# EAGLE design RGBLEDMatrixBPack (EAGLE 6.5.0)
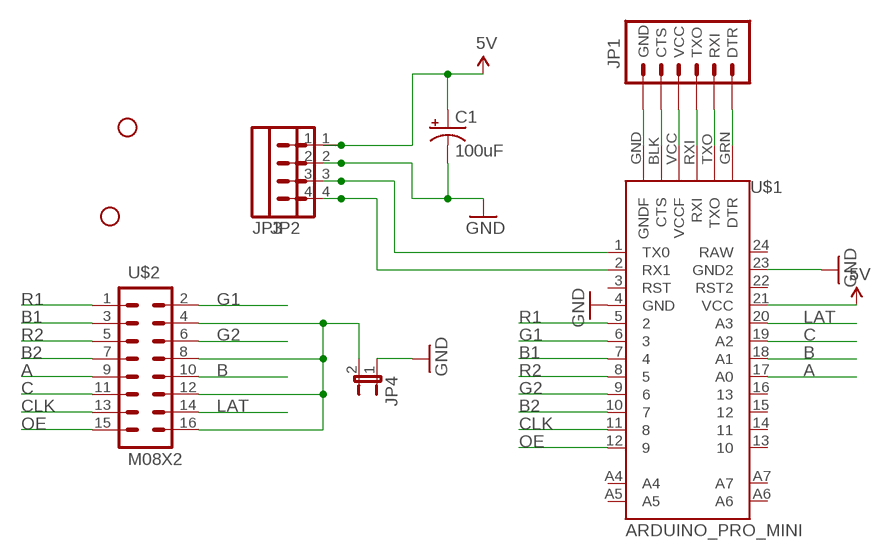
[diagram p0: schematic, sheet 1]

## Parts
C1  100uF  CAP_POLPTH1  [CPOL-RADIAL-100UF-25V]
JP1  ARDUINO_SERIAL_PROGRAMPTH  [1X06]
JP2  M04JST-PTH  [JST-4-PTH]
JP3  M04JST-PTH  [JST-4-PTH]
JP4  JUMPER-2SMD-NO  [SJ_2S-NO]
STANDOFF1  STAND-OFF  [STAND-OFF]
STANDOFF2  STAND-OFF  [STAND-OFF]
U$1  ARDUINO_PRO_MINI  [ARDUINO_PRO_MINI]
U$2  M08X2  [2X8]

## Nets
5V: C1.1(+) JP2.1 JP3.1 U$1.21(VCC)
A: U$1.17(A0) U$2.9
B: U$1.18(A1) U$2.10
B1: U$1.7 U$2.3
B2: U$1.10 U$2.7
C: U$1.19(A2) U$2.11
CLK: U$1.11 U$2.13
G1: U$1.6 U$2.2
G2: U$1.9 U$2.6
GND: C1.2(-) JP2.2 JP3.2 JP4.1 U$1.4(GND) U$1.23(GND2)
LAT: U$1.20(A3) U$2.14
N$1: JP1.1(DTR) U$1.GRN(DTR)
N$2: JP1.2(RXI) U$1.TXO
N$3: JP1.3(TXO) U$1.RXI
N$4: JP1.4(VCC) U$1.VCC(VCCF)
N$5: JP1.5(CTS) U$1.BLK(CTS)
N$6: JP1.6(GND) U$1.GND(GNDF)
N$7: JP2.4 JP3.4 U$1.2(RX1)
N$8: JP2.3 JP3.3 U$1.1(TX0)
N$9: JP4.2 U$2.4 U$2.8 U$2.12 U$2.16
OE: U$1.12 U$2.15
R1: U$1.5 U$2.1
R2: U$1.8 U$2.5
Unconnected: U$1.3(RST) U$1.13 U$1.14 U$1.15 U$1.16 U$1.22(RST2) U$1.24(RAW) U$1.A4 U$1.A5 U$1.A6 U$1.A7

## Library data of the parts
C1 = SparkFun-Capacitors:CAP_POL: Capacitor Polarized These are standard SMD and PTH capacitors. Normally 10uF, 47uF, and 100uF in electrolytic and tantalum varieties. Always verify the external diameter of the through hole cap, it varies with capacity, voltage, and manufacturer. The EIA devices should be standard.
JP1 = SparkFun-Connectors:ARDUINO_SERIAL_PROGRAM: FTDI connector footprints
JP2 JP3 = SparkFun-Connectors:M04: Header 4 Standard 4-pin 0.1" header. Use with straight break away headers (SKU : PRT-00116), right angle break away headers (PRT-00553), swiss pins (PRT-00743), machine pins (PRT-00117), and female headers (PRT-00115). Molex polarized connector foot print use with SKU : PRT-08231 with associated crimp pins and housings. 1MM SMD Version SKU: PRT-10208
JP4 = SparkFun-Passives:JUMPER-2: Jumper Basic 0.1" spaced jumper. Use with breakaway headers.
STANDOFF1 STANDOFF2 = SparkFun-Electromechanical:STAND-OFF: #4 Stand Off This is the mechanical footprint for a #4 phillips button head screw. Use the keepout ring to avoid running the screw head into surrounding components. SKU : PRT-00447
U$1 = SparkFun-Boards:ARDUINO_PRO_MINI
U$2 = SparkFun-Connectors:M08X2: .1" headers, two rows of 8 each

## Net classes
0 default: width 0.254 mm

## Board
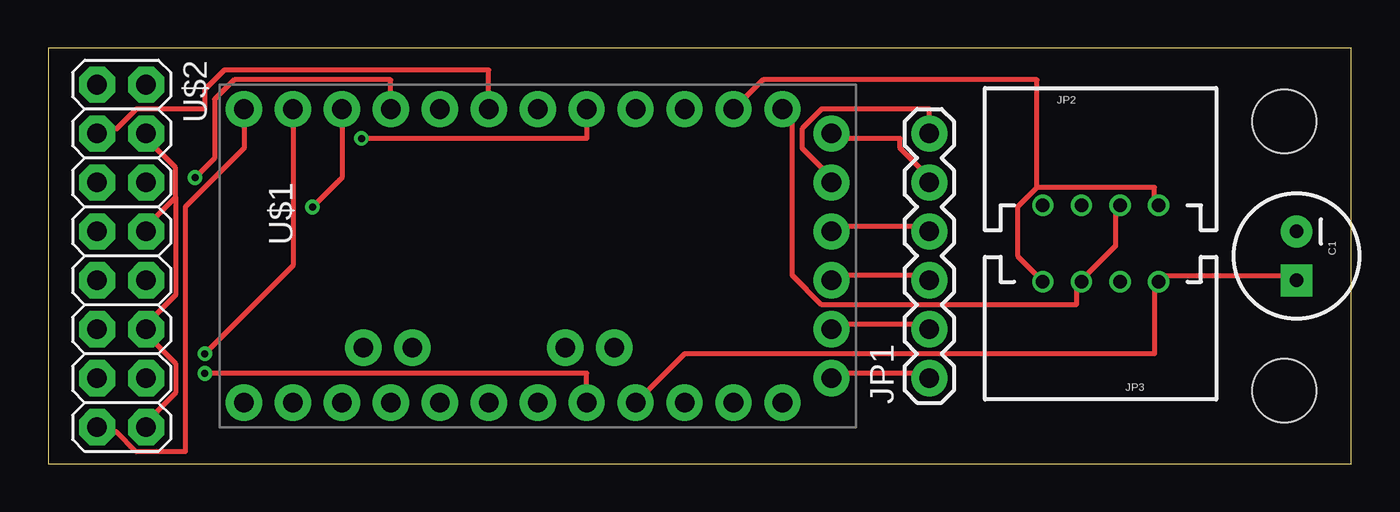
[diagram p1: board, top side]
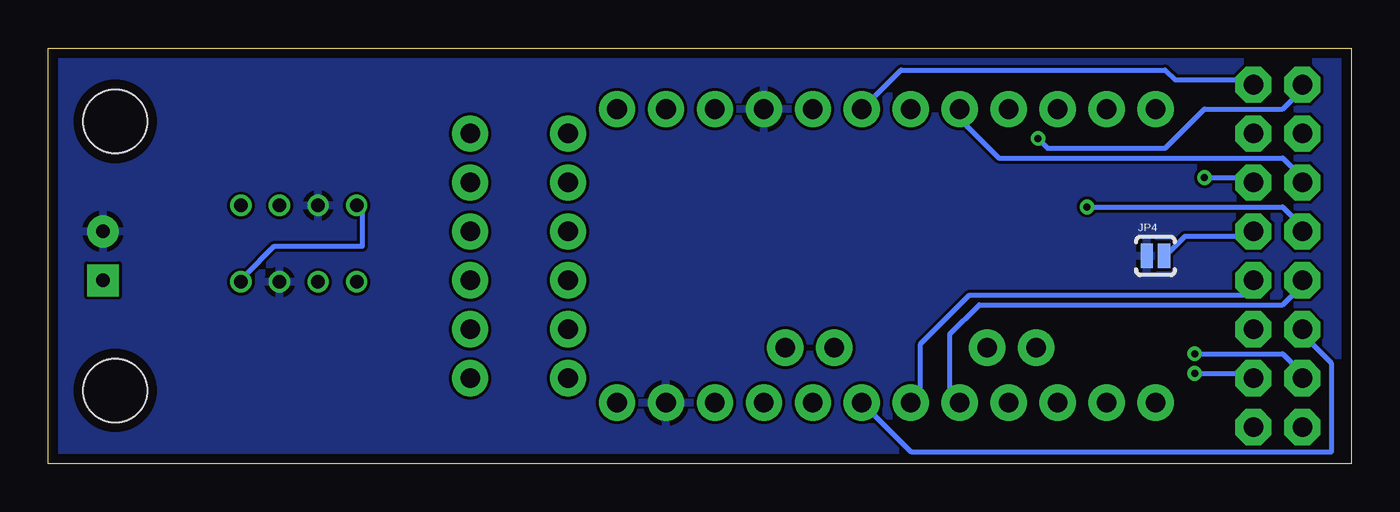
[diagram p2: board, bottom side, seen from below]

Size 67.61 x 21.58 mm. Coordinates in mm from the lower left corner, seen from the top.
Outline: 0,0 67.61,0 67.61,21.58 0,21.58 0,0
Copper layers (1*16): Top 0.0178mm / dielectric 59mil / Bottom 0.0178mm
Design rules "SSC-EAGLE-2Lyr_v1.0.0.3": minimum track width 6mil, minimum drill 14mil, track to track 6mil, track to pad 6mil, pad to pad 6mil, via to via 6mil, smd to smd 6mil, copper to edge 20mil, drill to drill 16mil, minimum pad ring 8mil, minimum via ring 8mil, stop-mask expansion 3mil, vias tented up to drill 0mil, thermal gap 10mil

### Footprints (pad centres in the part's own frame; a part is rotated, then mirrored left to right if it is on the bottom)
CPOL-RADIAL-100UF-25V = drill 0.7 pad 1.651 square: 1 1.27,0 | drill 0.7 pad 1.651: 2 -1.27,0
1X06 = drill 1.016 pad 1.88: 1 0,0; 2 2.54,0; 3 5.08,0; 4 7.62,0; 5 10.16,0; 6 12.7,0
JST-4-PTH = drill 0.7: 1 -3,-5; 2 -1,-5; 3 1,-5; 4 3,-5
SJ_2S-NO = smd 0.635 x 1.27: 1 -0.45,0; 2 0.45,0
STAND-OFF = hole 3.302: 0,0
ARDUINO_PRO_MINI = drill 1.016 pad 1.88: 1 -7.62,12.7; 2 -7.62,10.16; 3 -7.62,7.62; 4 -7.62,5.08; 5 -7.62,2.54; 6 -7.62,0; 7 -7.62,-2.54; 8 -7.62,-5.08; 9 -7.62,-7.62; 10 -7.62,-10.16; 11 -7.62,-12.7; 12 -7.62,-15.24; 13 7.62,-15.24; 14 7.62,-12.7; 15 7.62,-10.16; 16 7.62,-7.62; 17 7.62,-5.08; 18 7.62,-2.54; 19 7.62,0; 20 7.62,2.54; 21 7.62,5.08; 22 7.62,7.62; 23 7.62,10.16; 24 7.62,12.7; A4 4.763,1.429; A5 4.763,3.969; A6 4.763,-9.049; A7 4.763,-6.509; BLK -6.35,15.24; GND -3.81,15.24; GRN 6.35,15.24; RXI 1.27,15.24; TXO 3.81,15.24; VCC -1.27,15.24
2X8 = drill 1.016 pad 1.88 octagon: 1 0,0; 2 0,2.54; 3 2.54,0; 4 2.54,2.54; 5 5.08,0; 6 5.08,2.54; 7 7.62,0; 8 7.62,2.54; 9 10.16,0; 10 10.16,2.54; 11 12.7,0; 12 12.7,2.54; 13 15.24,0; 14 15.24,2.54; 15 17.78,0; 16 17.78,2.54

### Placement (x,y rotation side)
C1  64.77,10.8 270 top
JP1  45.72,4.45 90 top
JP2  54.61,18.41 0 top
JP3  54.61,4.45 180 top
JP4  10.16,10.8 0 bottom
STANDOFF1  64.13,17.78 0 top
STANDOFF2  64.13,3.81 0 top
U$1  25.4,10.8 270 top
U$2  2.54,19.69 270 top

### Tracks (layer width: path | path; a pad name or v marks a point on that pad's centre or on a via)
5V
  Top 0.254: C1.1 64.52,9.78 57.91,9.78 JP3.1 57.4,9.27 57.4,5.72 33.02,5.72 U$1.21
  Bottom 0.254: JP2.1 51.31,13.34 51.31,11.3 55.88,11.3 57.4,9.78 JP3.1
A
  Bottom 0.254: U$1.17 20.83,3.18 20.83,6.73 19.3,8.26 3.56,8.26 2.54,9.27 U$2.9
B
  Bottom 0.254: U$1.18 22.35,3.18 22.35,6.22 19.81,8.76 5.59,8.76 5.08,9.27 U$2.10
B1
  Top 0.254: U$1.7 22.86,20.45 9.14,20.45 8.13,19.43 8.13,18.41 4.57,18.41 3.56,17.4 2.54,17.4 U$2.3
B2  (via drill 0.36)
  Top 0.254: v13.72,13.34 15.24,14.86 U$1.10
  Bottom 0.254: v13.72,13.34 3.56,13.34 2.54,12.32 U$2.7
C
  Bottom 0.254: U$1.19 22.86,0.64 1.02,0.64 1.02,5.21 2.54,6.73 U$2.11
CLK  (via drill 0.36)
  Top 0.254: v8.13,5.72 12.7,10.29 U$1.11
  Bottom 0.254: v8.13,5.72 3.56,5.72 2.54,4.7 U$2.13
G1
  Bottom 0.254: U$1.6 23.37,20.45 9.65,20.45 9.14,19.94 5.08,19.94 U$2.2
G2  (via drill 0.36)
  Top 0.254: v7.62,14.86 8.64,15.88 8.64,18.92 9.65,19.94 17.78,19.94 U$1.9
  Bottom 0.254: v7.62,14.86 5.08,14.86 U$2.6
GND
  pour Bottom: 0,22.23 68.58,22.23 68.58,-0.63 0,-0.63
LAT  (via drill 0.36)
  Top 0.254: v8.13,4.7 27.94,4.7 U$1.20
  Bottom 0.254: v8.13,4.7 5.08,4.7 U$2.14
N$1
  Top 0.254: U$1.GRN 40.64,4.7 45.72,4.7 JP1.1
N$2
  Top 0.254: U$1.TXO 40.64,7.24 45.72,7.24 JP1.2
N$3
  Top 0.254: U$1.RXI 40.64,9.78 45.72,9.78 JP1.3
N$4
  Top 0.254: U$1.VCC 40.64,12.32 45.72,12.32 JP1.4
N$5
  Top 0.254: U$1.BLK 40.64,16.89 44.2,16.89 44.2,16.38 45.72,14.86 JP1.5
N$6
  Top 0.254: JP1.6 45.72,18.41 40.13,18.41 39.12,17.4 39.12,16.38 40.64,14.86 U$1.GND
N$7
  Top 0.254: 51.31,14.35 50.29,13.34 50.29,10.8 51.31,9.78 JP3.4 | 51.31,14.35 57.4,14.35 57.4,13.84 JP2.4 | U$1.2 37.08,19.94 51.31,19.94 51.31,14.35
N$8
  Top 0.254: JP2.3 55.37,13.34 55.37,11.3 53.85,9.78 JP3.3 53.34,9.27 53.34,8.26 40.13,8.26 38.61,9.78 38.61,17.91 U$1.1
N$9
  Top 0.254: U$2.16 5.08,2.16 6.6,3.68 6.6,5.21 5.08,6.73 U$2.12 5.08,7.24 6.6,8.76 6.6,13.84 | 6.6,13.84 6.6,15.37 5.08,16.89 U$2.4 | 6.6,13.84 5.08,12.32 U$2.8
  Bottom 0.254: JP4.2 9.65,10.8 8.64,11.81 5.08,11.81 U$2.8
OE
  Top 0.254: U$1.12 10.16,16.38 7.11,13.34 7.11,0.64 4.57,0.64 3.56,1.65 2.54,1.65 U$2.15
R1  (via drill 0.36)
  Top 0.254: v16.26,16.89 27.94,16.89 U$1.5
  Bottom 0.254: v16.26,16.89 15.75,16.38 9.65,16.38 7.62,18.41 3.56,18.41 2.54,19.43 U$2.1
R2
  Bottom 0.254: U$1.8 20.32,17.91 18.29,15.88 3.56,15.88 2.54,14.86 U$2.5